# EAGLE design passiveXOR (EAGLE 8.4.3)
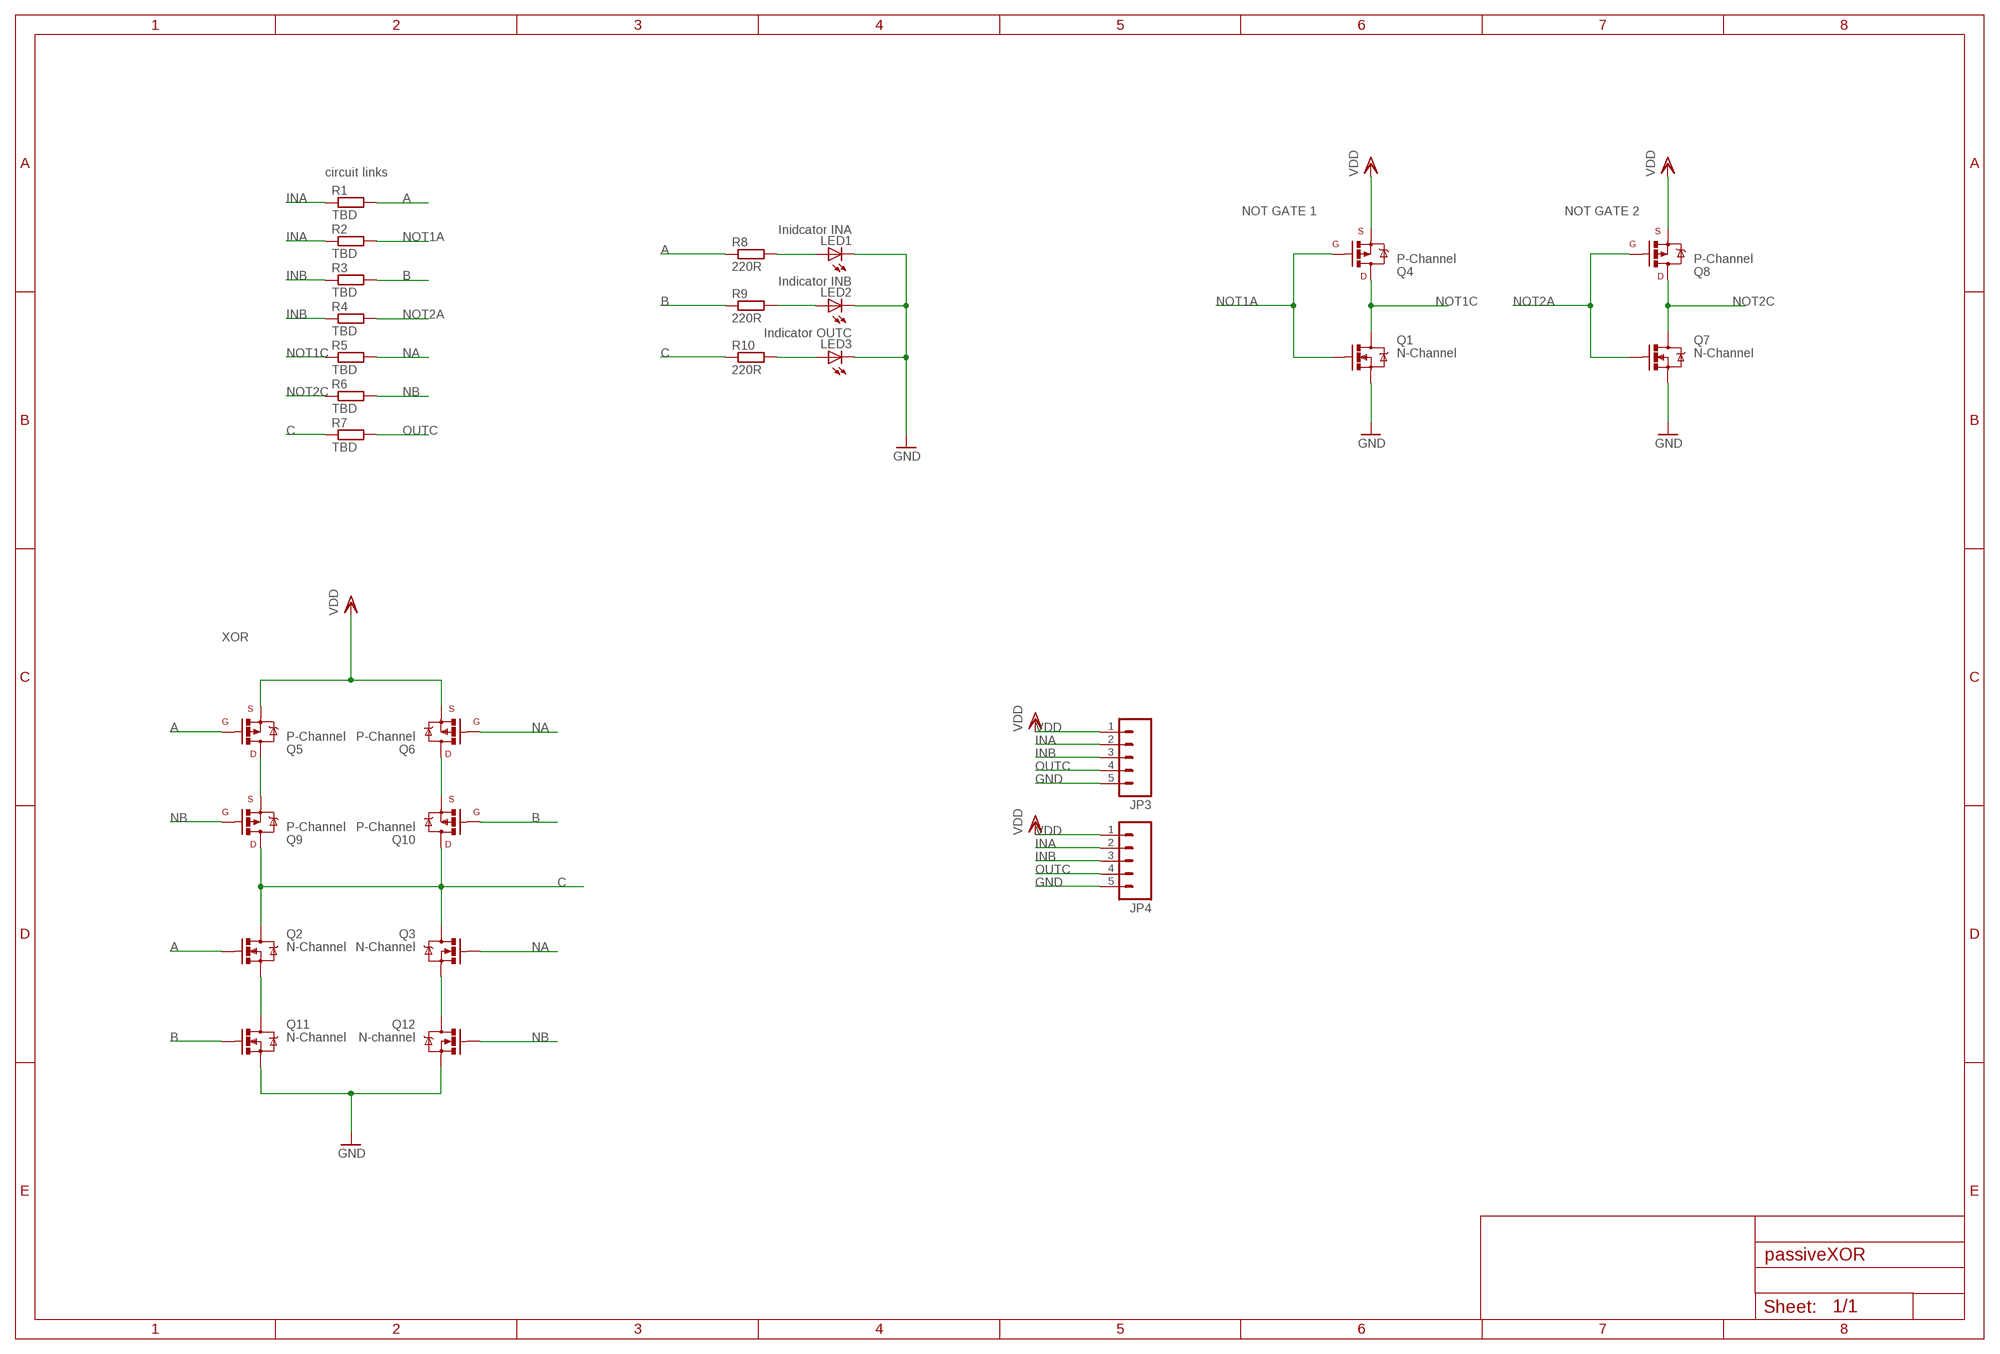
[diagram p0: schematic, sheet 1]

## Parts
JP3  M05NO_SILK  [1X05_NO_SILK]
JP4  M05NO_SILK  [1X05_NO_SILK]
LED1  Inidcator INA  LEDCHIPLED_0805  [CHIPLED_0805]
LED2  Indicator INB  LEDCHIPLED_0805  [CHIPLED_0805]
LED3  Indicator OUTC  LEDCHIPLED_0805  [CHIPLED_0805]
Q1  N-Channel  MOSFET-NCHANNEL  [SOT23]
Q2  N-Channel  MOSFET-NCHANNEL  [SOT23]
Q3  N-Channel  MOSFET-NCHANNEL  [SOT23]
Q4  P-Channel  MOSFET-PCHANNEL  [SOT23]
Q5  P-Channel  MOSFET-PCHANNEL  [SOT23]
Q6  P-Channel  MOSFET-PCHANNEL  [SOT23]
Q7  N-Channel  MOSFET-NCHANNEL  [SOT23]
Q8  P-Channel  MOSFET-PCHANNEL  [SOT23]
Q9  P-Channel  MOSFET-PCHANNEL  [SOT23]
Q10  P-Channel  MOSFET-PCHANNEL  [SOT23]
Q11  N-Channel  MOSFET-NCHANNEL  [SOT23]
Q12  N-channel  MOSFET-NCHANNEL  [SOT23]
R1  TBD  R-EU_R0603  [R0603]
R2  TBD  R-EU_R0603  [R0603]
R3  TBD  R-EU_R0603  [R0603]
R4  TBD  R-EU_R0603  [R0603]
R5  TBD  R-EU_R0603  [R0603]
R6  TBD  R-EU_R0603  [R0603]
R7  TBD  R-EU_R0603  [R0603]
R8  220R  R-EU_R0603  [R0603]
R9  220R  R-EU_R0603  [R0603]
R10  220R  R-EU_R0603  [R0603]

## Nets
A: Q2.1(G) Q5.1(G) R1.2 R8.1
B: Q10.1(G) Q11.1(G) R3.2 R9.1
C: Q2.3(D) Q3.3(D) Q9.3(D) Q10.3(D) R7.1 R10.1
GND: JP3.5 JP4.5 LED1.C LED2.C LED3.C Q1.2(S) Q7.2(S) Q11.2(S) Q12.2(S)
INA: JP3.2 JP4.2 R1.1 R2.1
INB: JP3.3 JP4.3 R3.1 R4.1
N$1: LED1.A R8.2
N$2: Q5.3(D) Q9.2(S)
N$3: Q6.3(D) Q10.2(S)
N$4: LED2.A R9.2
N$5: LED3.A R10.2
N$20: Q2.2(S) Q11.3(D)
N$21: Q3.2(S) Q12.3(D)
NA: Q3.1(G) Q6.1(G) R5.2
NB: Q9.1(G) Q12.1(G) R6.2
NOT1A: Q1.1(G) Q4.1(G) R2.2
NOT1C: Q1.3(D) Q4.3(D) R5.1
NOT2A: Q7.1(G) Q8.1(G) R4.2
NOT2C: Q7.3(D) Q8.3(D) R6.1
OUTC: JP3.4 JP4.4 R7.2
VDD: JP3.1 JP4.1 Q4.2(S) Q5.2(S) Q6.2(S) Q8.2(S)

## Notes on the sheet
- circuit links
- NOT GATE 1 | NOT GATE 2
- XOR

## Library data of the parts
JP3 JP4 = SparkFun-Connectors:M05: Header 5 Standard 5-pin 0.1" header. Use with straight break away headers (SKU : PRT-00116), right angle break away headers (PRT-00553), swiss pins (PRT-00743), machine pins (PRT-00117), and female headers (PRT-00115). Molex polarized connector foot print use with SKU : PRT-08230 with associated crimp pins and housings.
LED1-LED3 = led:LED: LED OSRAM: - CHIPLED LG R971, LG N971, LY N971, LG Q971, LY Q971, LO R971, LY R971 LH N974, LH R974 LS Q976, LO Q976, LY Q976 LO Q996 - Hyper CHIPLED LW Q18S LB Q993, LB Q99A, LB R99A - SideLED LS A670, LO A670, LY A670, LG A670, LP A670 LB A673, LV A673, LT A673, LW A673 LH A674 LY A675 LS A676, LA A676, LO A676, LY A676, LW A676 LS A679, LY A679, LG A679 - Hyper Micro SIDELED® LS Y876, LA Y876, LO Y876, LY Y876 LT Y87S - SmartLED LW L88C, LW L88S LB L89C, LB L89S, LG L890 LS L89K, LO L89K, LY L89K LS L896, LA L896, LO L896, LY L896 - TOPLED LS T670, LO T670, LY T670, LG T670, LP T670 LSG T670, LSP T670, LSY T670, LOP T670, LYG T670 LG T671, LOG T671, LSG T671 LB T673, LV T673, LT T673, LW T673 LH T674 LS T676, LA T676, LO T676, LY T676, LB T676, LH T676, LSB T676, LW T676 LB T67C, LV T67C, LT T67C, LS T67K, LO T67K, LY T67K, LW E67C LS E67B, LA E67B, LO E67B, LY E67B, LB E67C, LV E67C, LT E67C LW T67C LS T679, LY T679, LG T679 LS T770, LO T770, LY T770, LG T770, LP T770 LB T773, LV T773, LT T773, LW T773 LH T774 LS E675, LA E675, LY E675, LS T675 LS T776, LA T776, LO T776, LY T776, LB T776 LHGB T686 LT T68C, LB T68C - Hyper Mini TOPLED® LB M676 - Mini TOPLED Santana® LG M470 LS M47K, LO M47K, LY M47K Source: http://www.osram.convergy.de LUXEON: - LUMILED® LXK2-PW12-R00, LXK2-PW12-S00, LXK2-PW14-U00, LXK2-PW14-V00 LXK2-PM12-R00, LXK2-PM12-S00, LXK2-PM14-U00 LXK2-PE12-Q00, LXK2-PE12-R00, LXK2-PE12-S00, LXK2-PE14-T00, LXK2-PE14-U00 LXK2-PB12-K00, LXK2-PB12-L00, LXK2-PB12-M00, LXK2-PB14-N00, LXK2-PB14-P00, LXK2-PB14-Q00 LXK2-PR12-L00, LXK2-PR12-M00, LXK2-PR14-Q00, LXK2-PR14-R00 LXK2-PD12-Q00, LXK2-PD12-R00, LXK2-PD12-S00 LXK2-PH12-R00, LXK2-PH12-S00 LXK2-PL12-P00, LXK2-PL12-Q00, LXK2-PL12-R00 Source: www.luxeon.com KINGBRIGHT: KA-3528ASYC Source: www.kingbright.com
Q1-Q3 Q7 Q11 Q12 = pimoroni-passives:MOSFET-NCHANNEL
Q4-Q6 Q8-Q10 = pimoroni-passives:MOSFET-PCHANNEL: Generic PMOSFET
R1-R10 = rcl:R-EU_: RESISTOR, European symbol

## Board
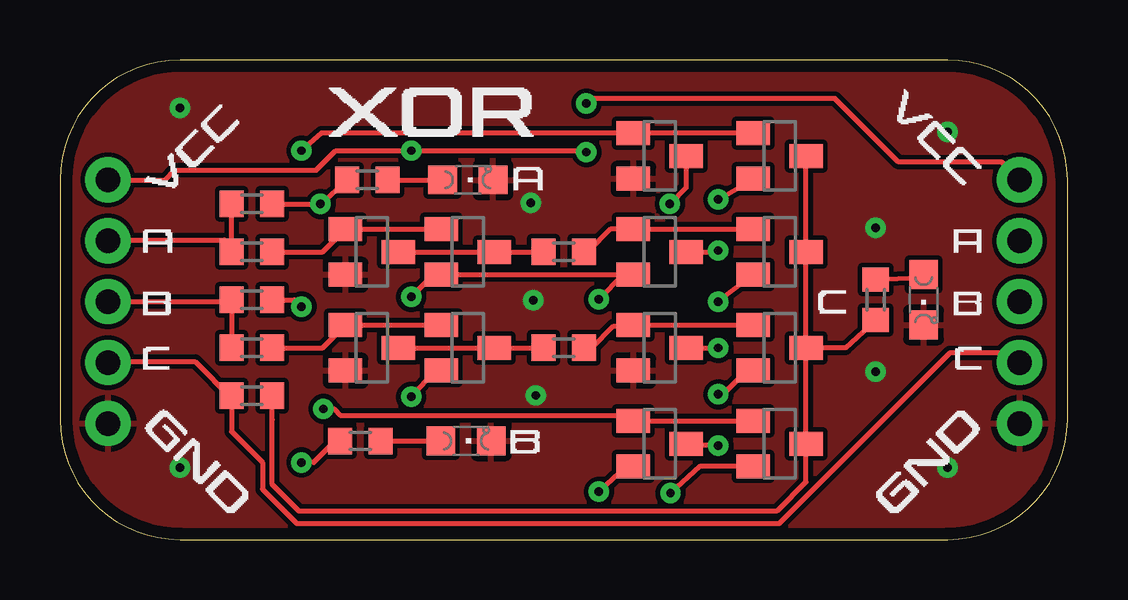
[diagram p1: board, top side]
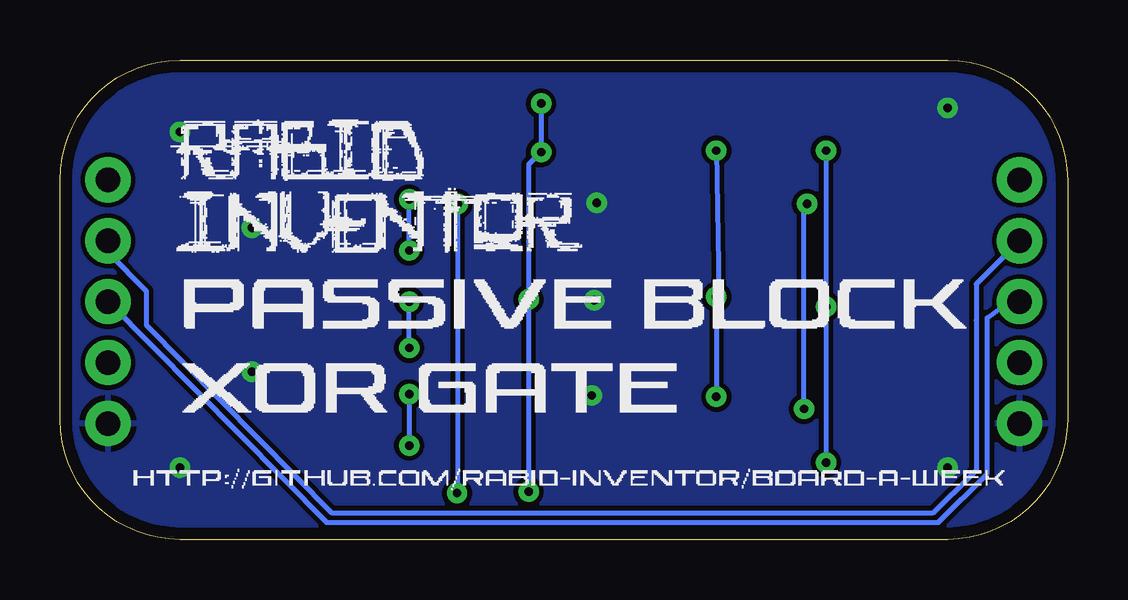
[diagram p2: board, bottom side, seen from below]

Size 42 x 20 mm. Coordinates in mm from the lower left corner, seen from the top.
Outline: 0,15 0,5 arc90 5,0 37,0 arc90 42,5 42,15 arc90 37,20 5,20 arc90 0,15
Copper layers (1*16): Top 0.035mm / dielectric 1.5mm / Bottom 0.035mm
Design rules "pimoroni *": minimum track width 0.2mm, minimum drill 0.3mm, track to track 0.2mm, track to pad 0.2mm, pad to pad 0.2mm, via to via 0.2mm, smd to smd 0.15mm, copper to edge 0.5mm, drill to drill 0.15mm, minimum pad ring 0.3mm, minimum via ring 0.25mm, stop-mask expansion 0.05mm, vias tented up to drill 0.6mm, thermal gap 0.25mm

### Footprints (pad centres in the part's own frame; a part is rotated, then mirrored left to right if it is on the bottom)
1X05_NO_SILK = drill 1.016 pad 1.88: 1 0,0; 2 2.54,0; 3 5.08,0; 4 7.62,0; 5 10.16,0
CHIPLED_0805 = smd 1.2 x 1.2: A 0,-1.05; C 0,1.05
SOT23 = smd 1 x 1.4: 1 -0.95,-1.1; 2 0.95,-1.1; 3 0,1.1
R0603 = smd 1 x 1.1: 1 -0.85,0; 2 0.85,0

### Placement (x,y rotation side)
JP3  2,15 270 top
JP4  40,15 270 top
LED1  17,15 270 top
LED2  16.93,4.11 270 top
LED3  36,10 180 top
Q1  13,12 270 top
Q2  30,4 270 top
Q3  30,12 270 top
Q4  17,12 270 top
Q5  25,4 270 top
Q6  25,12 270 top
Q7  13,8 270 top
Q8  17,8 270 top
Q9  30,8 270 top
Q10  30,16 270 top
Q11  25,16 270 top
Q12  25,8 270 top
R1  8,14 0 top
R2  8,12 0 top
R3  8,10 0 top
R4  8,8 0 top
R5  21,12 0 top
R6  21,8 0 top
R7  8,6 180 top
R8  12.81,15 0 top
R9  12.52,4.11 0 top
R10  34,10 90 top

### Tracks (layer width: path | path; a pad name or v marks a point on that pad's centre or on a via)
A  (via drill 0.35)
  Top 0.203: 23.98,4.95 Q2.1 | 23.98,4.95 Q5.1 | R8.1 v10.86,14 10.96,14 R1.2 | v10.98,5.45 11.42,5.45 11.68,5.18 23.75,5.18 23.98,4.95
  Bottom 0.203: v10.98,5.45 10.98,13.97 v10.86,14
B  (via drill 0.35)
  Top 0.203: Q10.1 Q11.1 10.9,16.95 v10.07,16.22 | 10.07,9.7 10.07,9.61 | 10.07,9.7 v10.07,9.72 | R9.1 11.47,4.11 10.58,3.21 v10.07,3.21 | R3.2 9.77,10 10.07,9.7
  Bottom 0.203: v10.07,3.21 v10.07,9.72 v10.07,16.22
C
  Top 0.203: Q9.3 32.73,8 R10.1 | R7.1 8.85,5 8.85,2.3 9.97,1.18 29.88,1.18 31.1,2.4 Q2.3 Q9.3 | Q9.3 Q3.3 Q10.3
GND  (via drill 0.35)
  other vias: 5,3 37,3 37,17 34,7 34,13 5,18 19.73,9.97 19.63,14.04 19.83,6.01
  pour Top: -1,-1 -1,22 43,22 43,-1
  pour Bottom: -2,-2 -2,22 44,22 44,-2
INA
  Top 0.203: 7.15,12.19 R2.1 | 7.15,12.19 R1.1 | JP3.2 2.71,12.46 2.74,12.5 6.84,12.5 7.15,12.19
  Bottom 0.203: JP4.2 40,11.96 38.41,10.36 38.41,8.94 30.68,1.12 5.59,1.12 4.78,1.93 4.77,1.93 3.81,2.89 3.81,9.14 | 3.81,9.14 | JP3.2 3.81,10.65 3.81,9.14
INB
  Top 0.203: 7.15,9.96 R3.1 | 7.15,9.96 R4.1 | JP3.3 7.11,9.92 7.15,9.96
  Bottom 0.203: JP4.3 30.89,0.71 5.38,0.71 3.35,2.74 3.35,9.25 2.4,9.92 2.4,9.89 2.23,9.96 2.13,9.95 JP3.3
N$1
  Top 0.203: R8.2 LED1.A
N$2  (via drill 0.35)
  Top 0.203: Q9.2 28.64,7.05 27.65,6.06 v27.44,6.06 | v27.44,3.92 26.18,3.92 Q5.3
  Bottom 0.203: v27.44,6.06 v27.44,3.92
N$3  (via drill 0.35)
  Top 0.203: Q6.3 27.39,12 v27.44,12.05 | v27.44,14.19 28.85,15 Q10.2
  Bottom 0.203: v27.44,12.05 v27.44,14.19
N$4
  Top 0.203: R9.2 LED2.A
N$5
  Top 0.203: R10.2 36.29,10.95 LED3.A
N$20  (via drill 0.35)
  Top 0.203: Q11.3 26.1,14.67 v25.42,13.99 v25.41,13.98 | Q2.2 26.67,3.05 v25.45,1.93 25.41,1.89
  Bottom 0.203: v25.42,13.99 25.42,1.86 v25.45,1.93
N$21  (via drill 0.35)
  Top 0.203: Q3.2 27.56,10.03 v27.44,9.92 | Q12.3 26.61,7.97 26.53,7.99 v27.44,7.99
  Bottom 0.203: v27.44,7.99 v27.44,9.92
NA
  Top 0.203: R5.2 22,12 22.97,12.97 23.88,12.97 Q6.1 Q3.1
NB
  Top 0.203: R6.2 22.17,8 23.07,8.9 23.85,8.9 Q12.1 Q9.1
NOT1A
  Top 0.203: Q4.1 Q1.1 10.95,12 R2.2
NOT1C
  Top 0.203: Q1.3 Q4.3 R5.1
NOT2A
  Top 0.203: Q8.1 Q7.1 10.95,8 R4.2
NOT2C
  Top 0.203: Q7.3 Q8.3 R6.1
OUTC
  Top 0.203: 7.15,5.89 R7.2 | 7.15,5.89 7.15,4.51 8.44,3.21 8.44,2.1 9.87,0.67 29.98,0.67 37.09,7.79 39.9,7.79 40,7.69 JP4.4 | JP3.4 2.81,7.38 2.85,7.42 5.63,7.42 7.15,5.89
VDD  (via drill 0.35)
  Top 0.203: Q8.2 15.63,7.05 v14.64,5.96 | v14.64,10.12 15.57,11.05 Q4.2 Q6.2 23.49,11.05 v22.46,10.02 | Q5.2 23.62,3.05 v22.46,1.99 | JP3.1 4.38,15 4.79,15.41 10.68,15.41 11.49,16.22 v14.64,16.22 21.98,16.22 22.05,16.15 v21.95,16.15 | JP4.1 39.25,15.75 34.95,15.75 32.31,18.39 21.95,18.39 v21.95,18.19
  Bottom 0.203: v14.64,5.96 v14.64,10.12 14.54,10.22 v14.64,16.22 | v22.46,1.99 v22.46,10.02 22.46,15.64 v21.95,16.15 v21.95,18.19